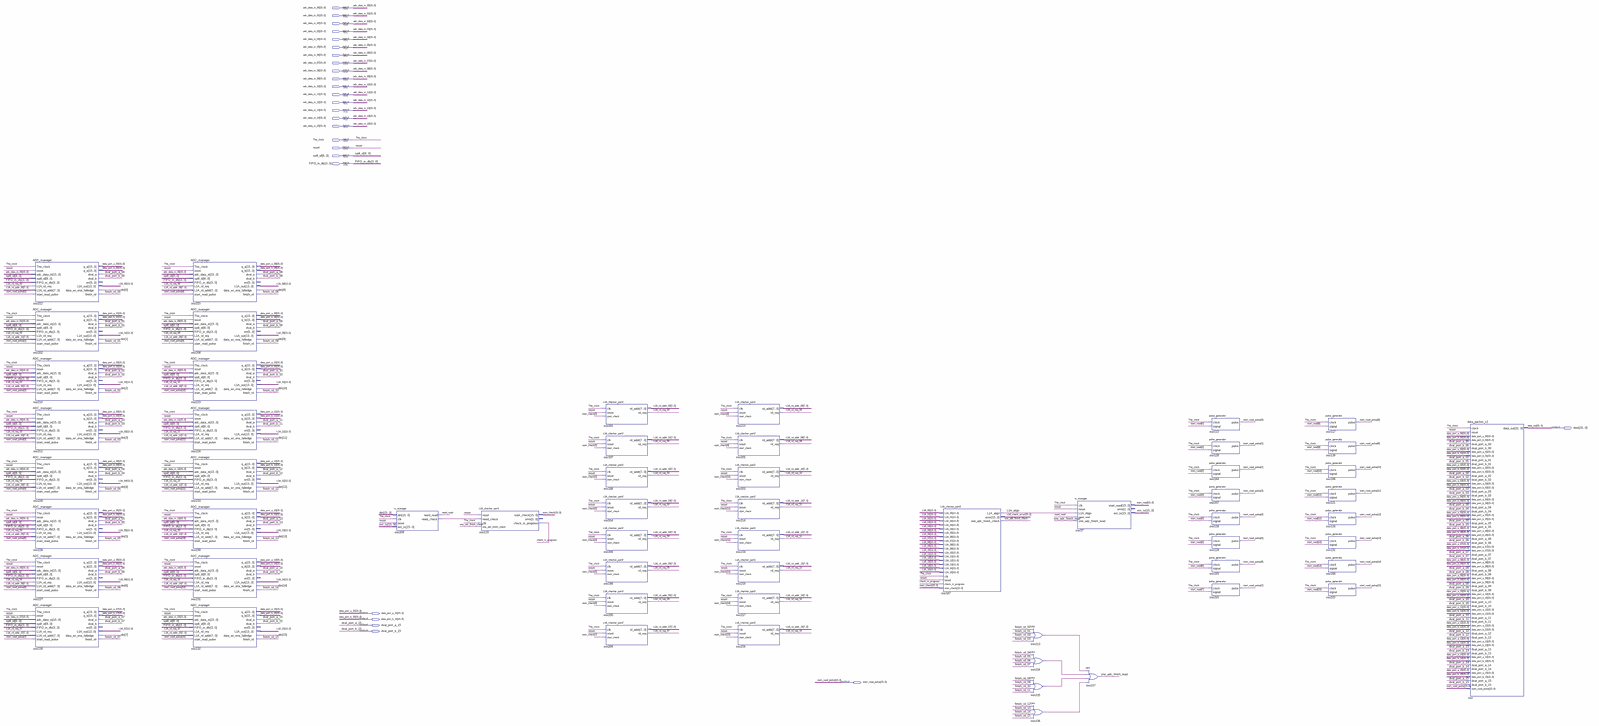
[diagram p0: schematic sheet, whole]
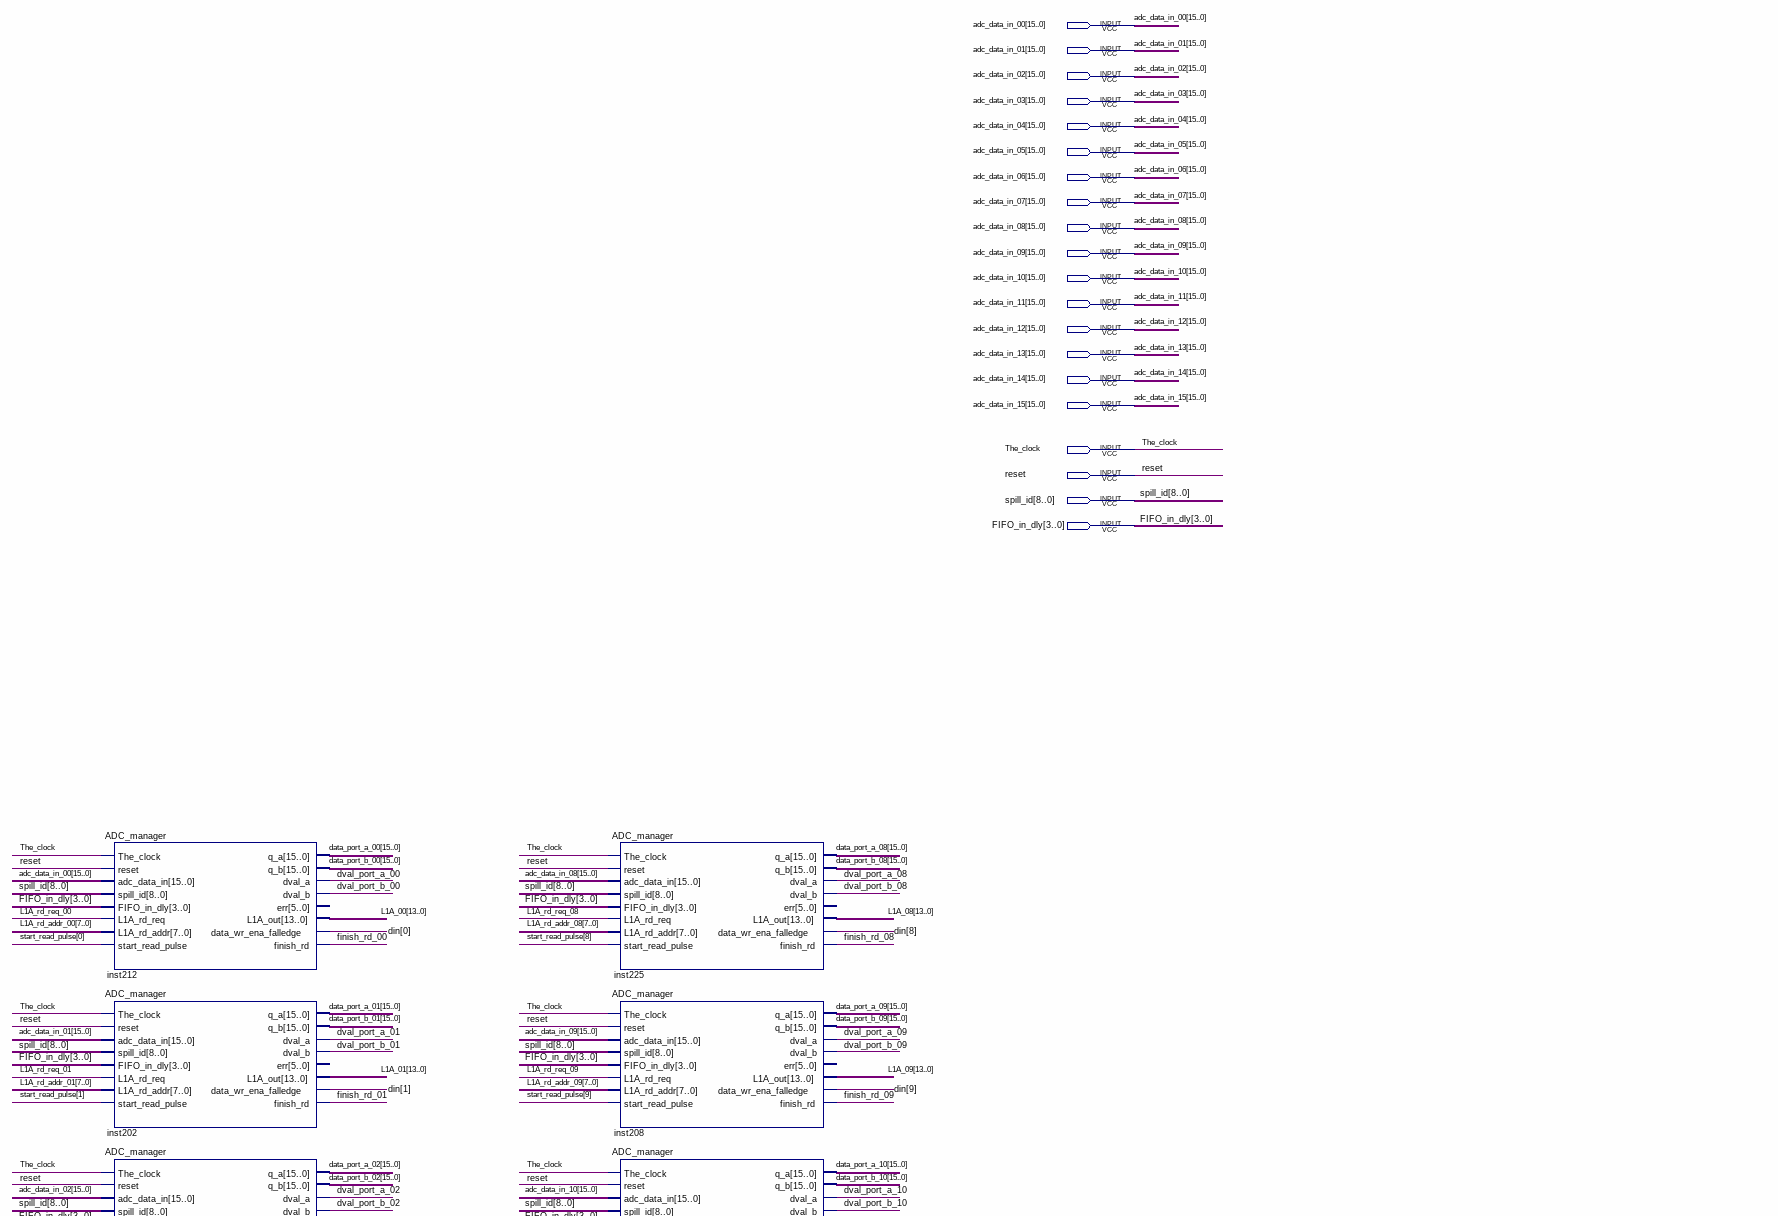
[diagram p1: schematic sheet, upper left part]
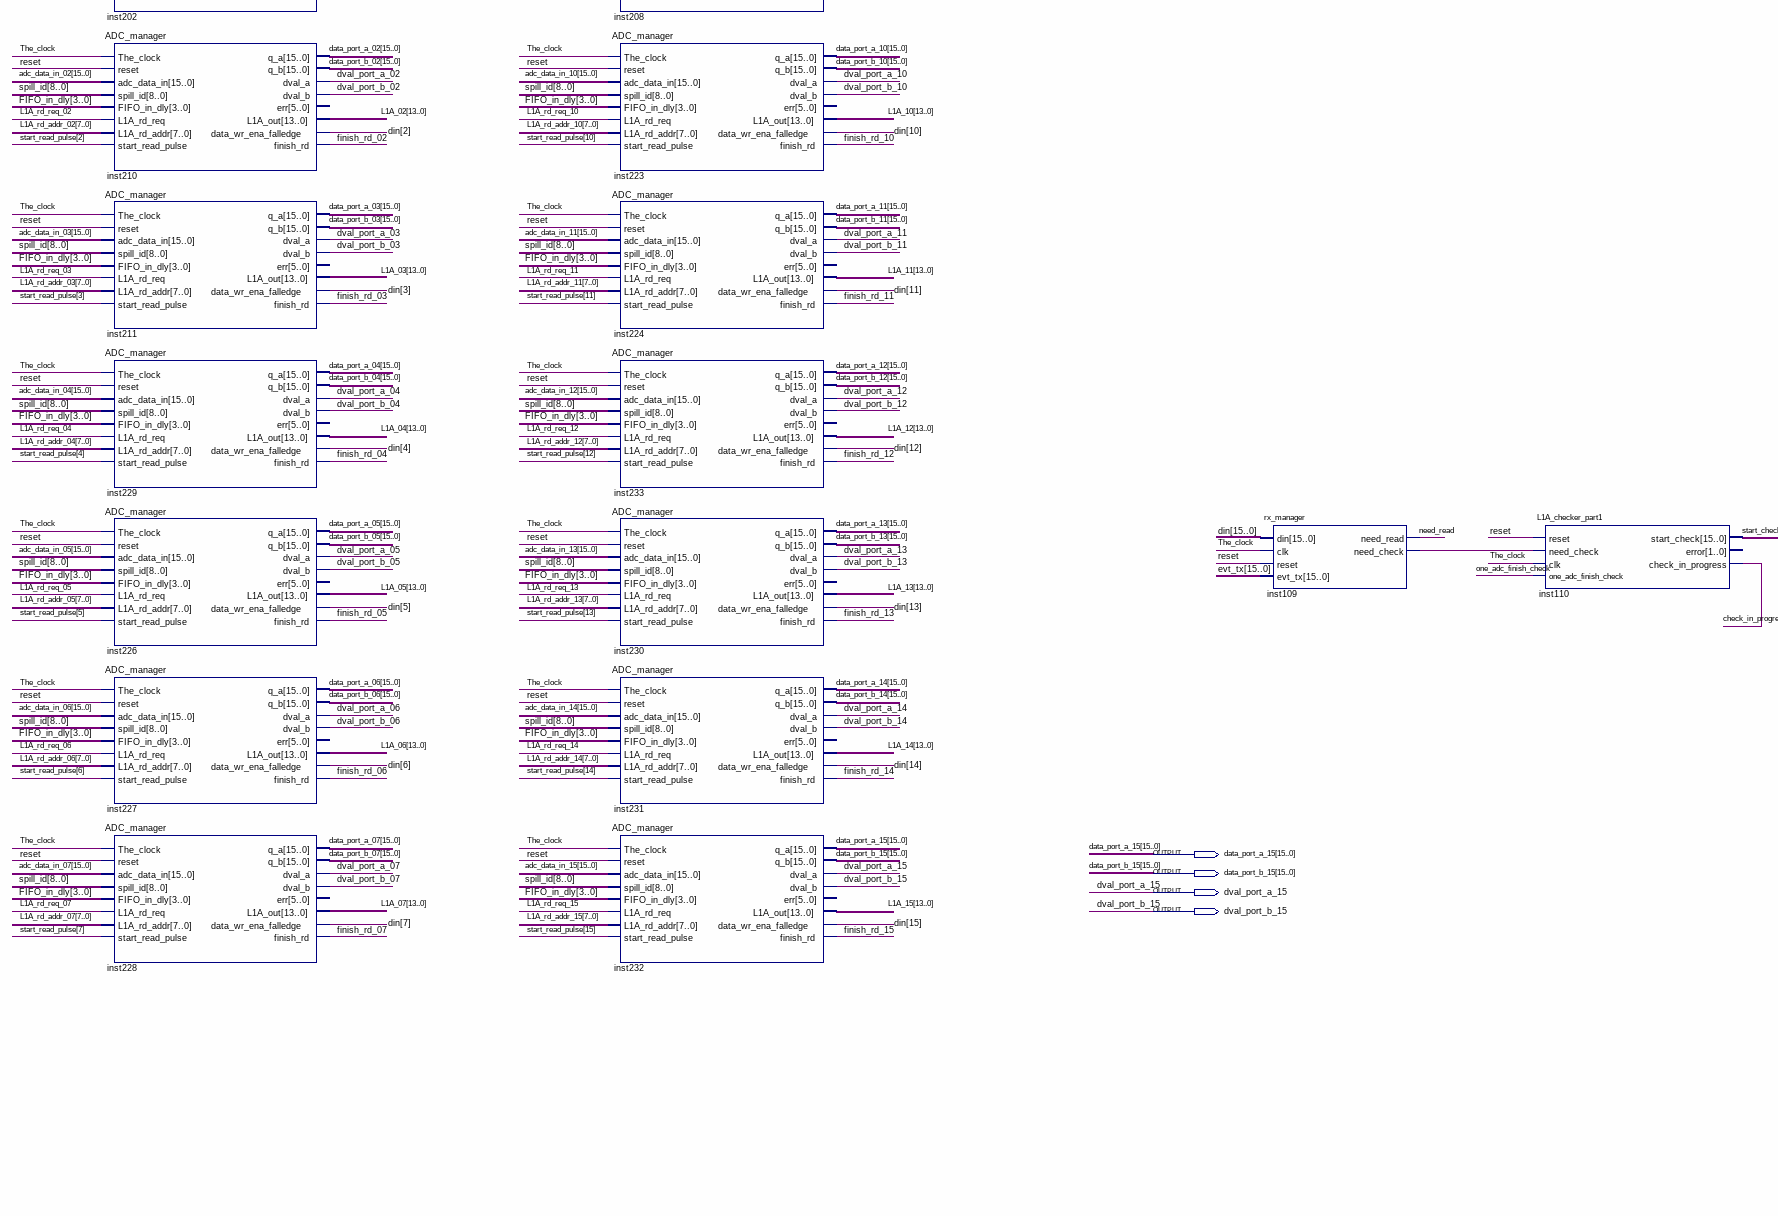
[diagram p2: schematic sheet, lower left part]
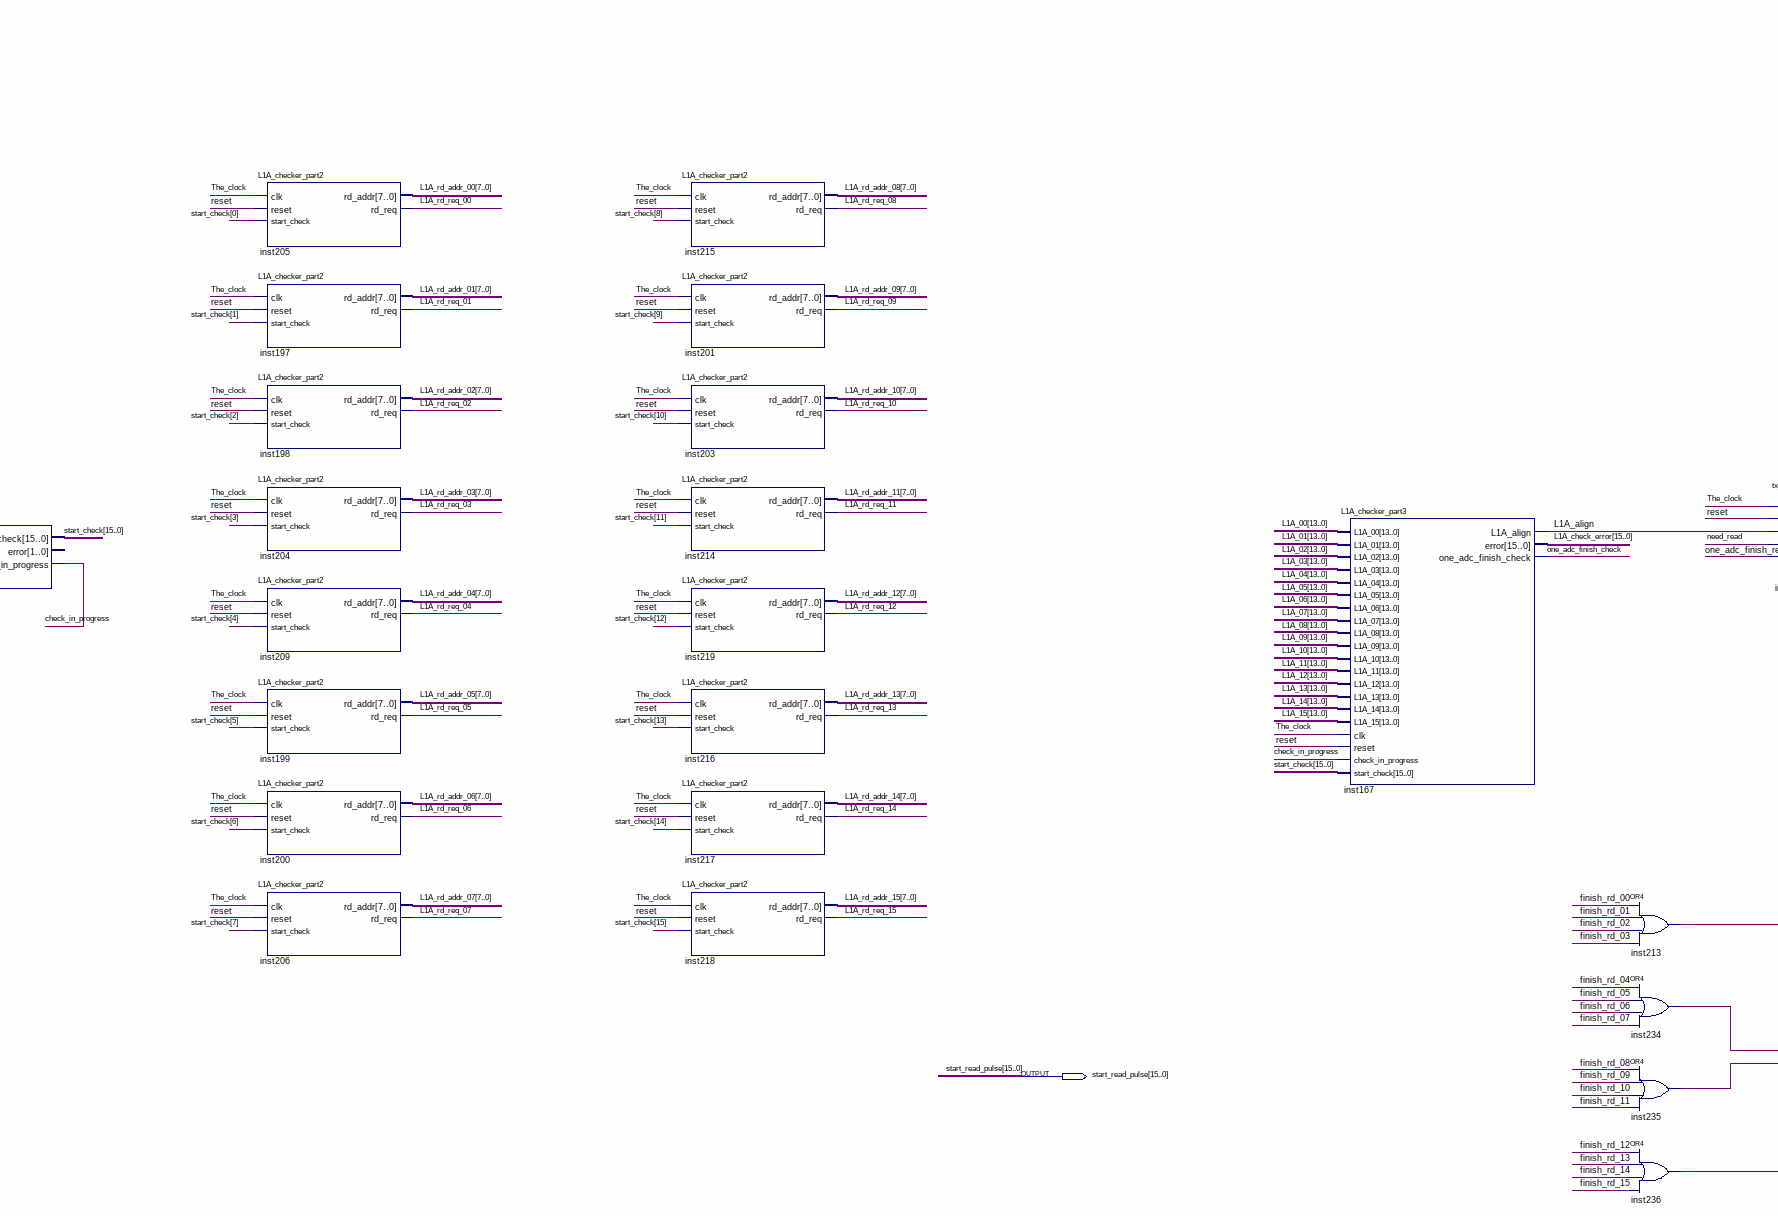
[diagram p3: schematic sheet, lower centre part]
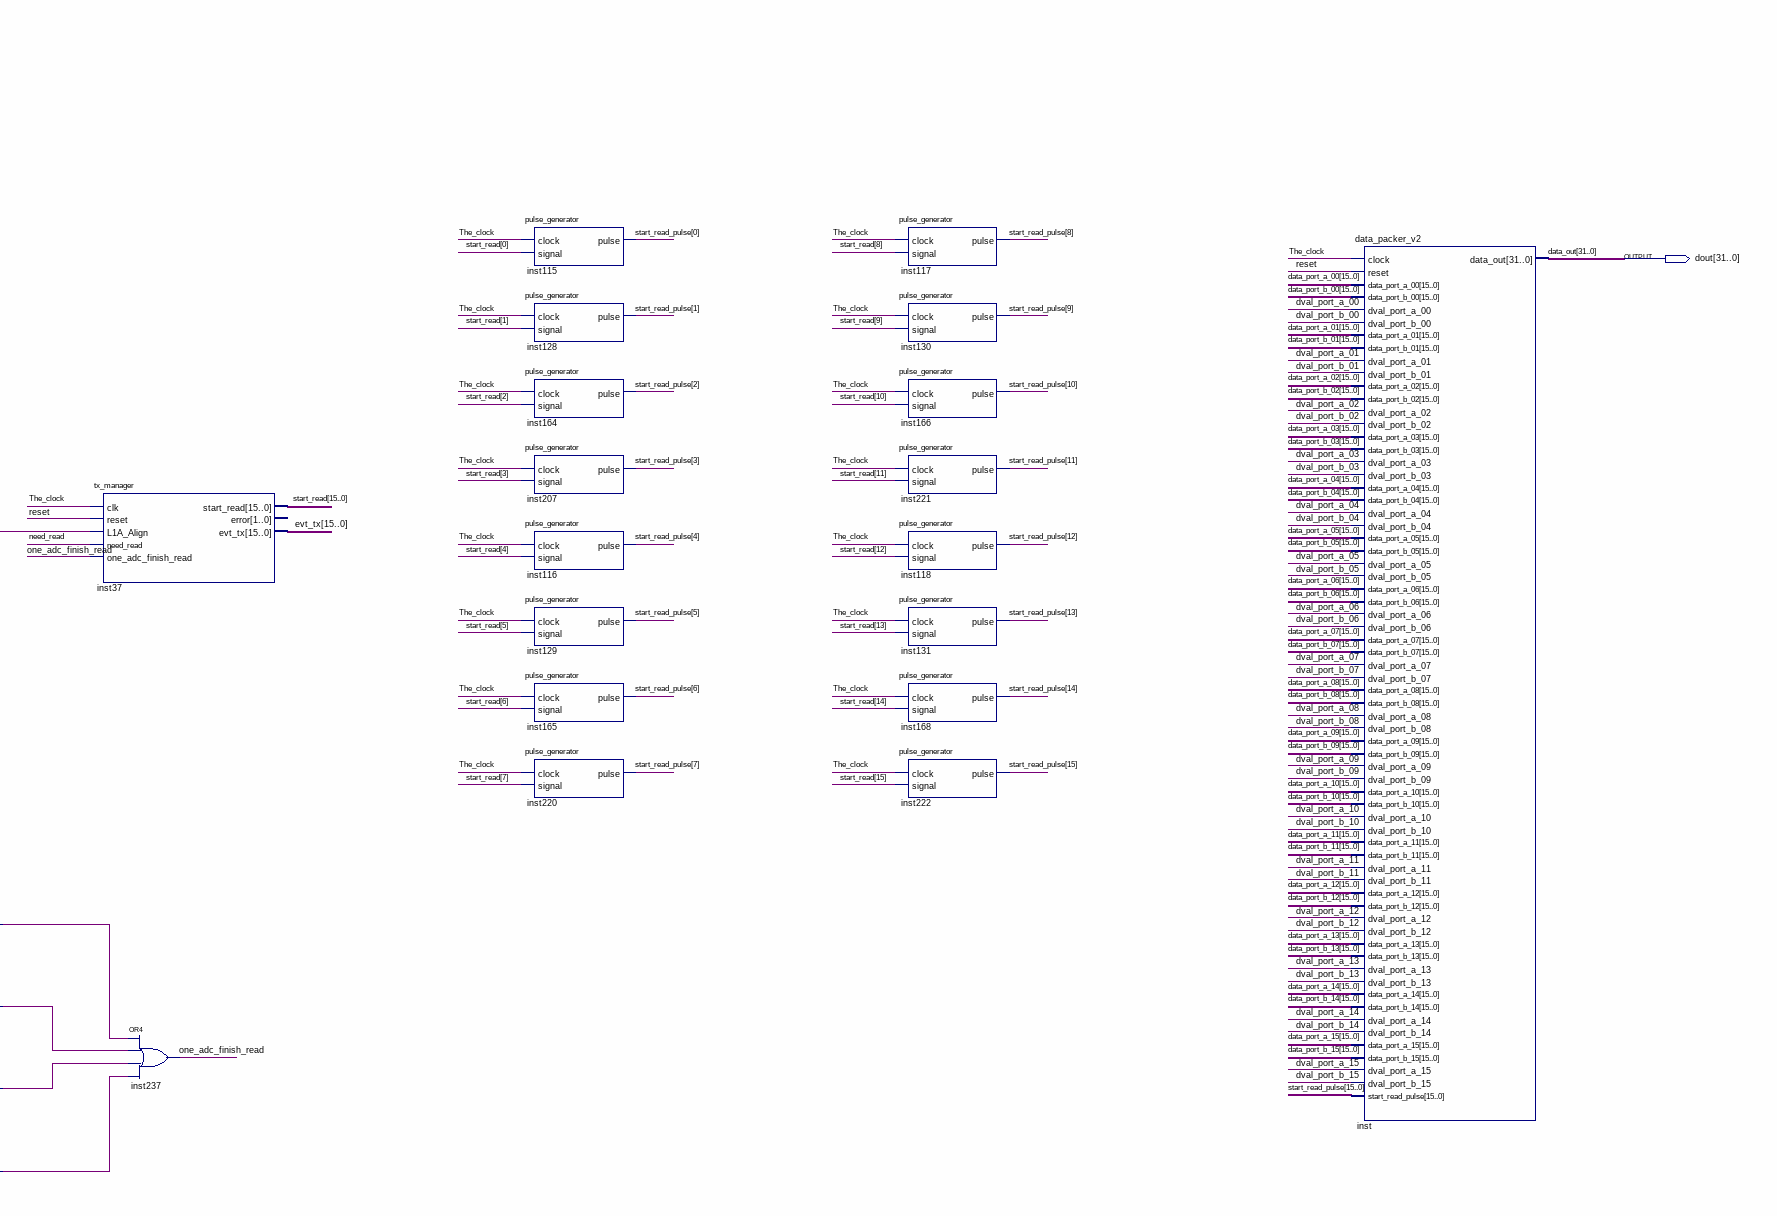
[diagram p4: schematic sheet, lower right part]
// Quartus schematic sim.bdf as structural Verilog: 58 symbols, 26 pins
module sim (
  input  [15:0] adc_data_in_00,
  input  [15:0] adc_data_in_01,
  input  [15:0] adc_data_in_02,
  input  [15:0] adc_data_in_03,
  input  [15:0] adc_data_in_04,
  input  [15:0] adc_data_in_05,
  input  [15:0] adc_data_in_06,
  input  [15:0] adc_data_in_07,
  input  [15:0] adc_data_in_08,
  input  [15:0] adc_data_in_09,
  input  [15:0] adc_data_in_10,
  input  [15:0] adc_data_in_11,
  input  [15:0] adc_data_in_12,
  input  [15:0] adc_data_in_13,
  input  [15:0] adc_data_in_14,
  input  [15:0] adc_data_in_15,
  input  The_clock,
  input  reset,
  input  [8:0] spill_id,
  input  [3:0] FIFO_in_dly,
  output [31:0] dout,
  output [15:0] data_port_a_15,
  output [15:0] data_port_b_15,
  output dval_port_a_15,
  output dval_port_b_15,
  output [15:0] start_read_pulse
);

  wire check_in_progress, dval_port_a_00, dval_port_a_01, dval_port_a_02, dval_port_a_03, dval_port_a_04,
       dval_port_a_05, dval_port_a_06, dval_port_a_07, dval_port_a_08, dval_port_a_09, dval_port_a_10,
       dval_port_a_11, dval_port_a_12, dval_port_a_13, dval_port_a_14, dval_port_b_00, dval_port_b_01,
       dval_port_b_02, dval_port_b_03, dval_port_b_04, dval_port_b_05, dval_port_b_06, dval_port_b_07,
       dval_port_b_08, dval_port_b_09, dval_port_b_10, dval_port_b_11, dval_port_b_12, dval_port_b_13,
       dval_port_b_14, finish_rd_00, finish_rd_01, finish_rd_02, finish_rd_03, finish_rd_04, finish_rd_05,
       finish_rd_06, finish_rd_07, finish_rd_08, finish_rd_09, finish_rd_10, finish_rd_11, finish_rd_12,
       finish_rd_13, finish_rd_14, finish_rd_15, inst109_need_check, inst213_out, inst234_out, inst235_out,
       inst236_out, L1A_align, L1A_rd_req_00, L1A_rd_req_01, L1A_rd_req_02, L1A_rd_req_03, L1A_rd_req_04,
       L1A_rd_req_05, L1A_rd_req_06, L1A_rd_req_07, L1A_rd_req_08, L1A_rd_req_09, L1A_rd_req_10,
       L1A_rd_req_11, L1A_rd_req_12, L1A_rd_req_13, L1A_rd_req_14, L1A_rd_req_15, need_read,
       one_adc_finish_check, one_adc_finish_read;
  wire [7:0] L1A_rd_addr_00, L1A_rd_addr_01, L1A_rd_addr_02, L1A_rd_addr_03, L1A_rd_addr_04, L1A_rd_addr_05,
       L1A_rd_addr_06, L1A_rd_addr_07, L1A_rd_addr_08, L1A_rd_addr_09, L1A_rd_addr_10, L1A_rd_addr_11,
       L1A_rd_addr_12, L1A_rd_addr_13, L1A_rd_addr_14, L1A_rd_addr_15;
  wire [13:0] L1A_00, L1A_01, L1A_02, L1A_03, L1A_04, L1A_05, L1A_06, L1A_07, L1A_08, L1A_09, L1A_10, L1A_11,
       L1A_12, L1A_13, L1A_14, L1A_15;
  wire [15:0] data_port_a_00, data_port_a_01, data_port_a_02, data_port_a_03, data_port_a_04, data_port_a_05,
       data_port_a_06, data_port_a_07, data_port_a_08, data_port_a_09, data_port_a_10, data_port_a_11,
       data_port_a_12, data_port_a_13, data_port_a_14, data_port_b_00, data_port_b_01, data_port_b_02,
       data_port_b_03, data_port_b_04, data_port_b_05, data_port_b_06, data_port_b_07, data_port_b_08,
       data_port_b_09, data_port_b_10, data_port_b_11, data_port_b_12, data_port_b_13, data_port_b_14, din,
       evt_tx, L1A_check_error, start_check, start_read;

  ADC_manager inst212 (
    .The_clock(The_clock), .reset(reset), .adc_data_in(adc_data_in_00), .spill_id(spill_id),
    .FIFO_in_dly(FIFO_in_dly), .L1A_rd_req(L1A_rd_req_00), .L1A_rd_addr(L1A_rd_addr_00),
    .start_read_pulse(start_read_pulse[0]), .q_a(data_port_a_00), .dval_a(dval_port_a_00),
    .q_b(data_port_b_00), .dval_b(dval_port_b_00), .L1A_out(L1A_00), .data_wr_ena_falledge(din[0]),
    .finish_rd(finish_rd_00));  // open: err
  ADC_manager inst202 (
    .The_clock(The_clock), .reset(reset), .adc_data_in(adc_data_in_01), .spill_id(spill_id),
    .FIFO_in_dly(FIFO_in_dly), .L1A_rd_req(L1A_rd_req_01), .L1A_rd_addr(L1A_rd_addr_01),
    .start_read_pulse(start_read_pulse[1]), .q_a(data_port_a_01), .dval_a(dval_port_a_01),
    .q_b(data_port_b_01), .dval_b(dval_port_b_01), .L1A_out(L1A_01), .data_wr_ena_falledge(din[1]),
    .finish_rd(finish_rd_01));  // open: err
  ADC_manager inst210 (
    .The_clock(The_clock), .reset(reset), .adc_data_in(adc_data_in_02), .spill_id(spill_id),
    .FIFO_in_dly(FIFO_in_dly), .L1A_rd_req(L1A_rd_req_02), .L1A_rd_addr(L1A_rd_addr_02),
    .start_read_pulse(start_read_pulse[2]), .q_a(data_port_a_02), .dval_a(dval_port_a_02),
    .q_b(data_port_b_02), .dval_b(dval_port_b_02), .L1A_out(L1A_02), .data_wr_ena_falledge(din[2]),
    .finish_rd(finish_rd_02));  // open: err
  ADC_manager inst211 (
    .The_clock(The_clock), .reset(reset), .adc_data_in(adc_data_in_03), .spill_id(spill_id),
    .FIFO_in_dly(FIFO_in_dly), .L1A_rd_req(L1A_rd_req_03), .L1A_rd_addr(L1A_rd_addr_03),
    .start_read_pulse(start_read_pulse[3]), .q_a(data_port_a_03), .dval_a(dval_port_a_03),
    .q_b(data_port_b_03), .dval_b(dval_port_b_03), .L1A_out(L1A_03), .data_wr_ena_falledge(din[3]),
    .finish_rd(finish_rd_03));  // open: err
  ADC_manager inst229 (
    .The_clock(The_clock), .reset(reset), .adc_data_in(adc_data_in_04), .spill_id(spill_id),
    .FIFO_in_dly(FIFO_in_dly), .L1A_rd_req(L1A_rd_req_04), .L1A_rd_addr(L1A_rd_addr_04),
    .start_read_pulse(start_read_pulse[4]), .q_a(data_port_a_04), .dval_a(dval_port_a_04),
    .q_b(data_port_b_04), .dval_b(dval_port_b_04), .L1A_out(L1A_04), .data_wr_ena_falledge(din[4]),
    .finish_rd(finish_rd_04));  // open: err
  ADC_manager inst226 (
    .The_clock(The_clock), .reset(reset), .adc_data_in(adc_data_in_05), .spill_id(spill_id),
    .FIFO_in_dly(FIFO_in_dly), .L1A_rd_req(L1A_rd_req_05), .L1A_rd_addr(L1A_rd_addr_05),
    .start_read_pulse(start_read_pulse[5]), .q_a(data_port_a_05), .dval_a(dval_port_a_05),
    .q_b(data_port_b_05), .dval_b(dval_port_b_05), .L1A_out(L1A_05), .data_wr_ena_falledge(din[5]),
    .finish_rd(finish_rd_05));  // open: err
  ADC_manager inst227 (
    .The_clock(The_clock), .reset(reset), .adc_data_in(adc_data_in_06), .spill_id(spill_id),
    .FIFO_in_dly(FIFO_in_dly), .L1A_rd_req(L1A_rd_req_06), .L1A_rd_addr(L1A_rd_addr_06),
    .start_read_pulse(start_read_pulse[6]), .q_a(data_port_a_06), .dval_a(dval_port_a_06),
    .q_b(data_port_b_06), .dval_b(dval_port_b_06), .L1A_out(L1A_06), .data_wr_ena_falledge(din[6]),
    .finish_rd(finish_rd_06));  // open: err
  ADC_manager inst228 (
    .The_clock(The_clock), .reset(reset), .adc_data_in(adc_data_in_07), .spill_id(spill_id),
    .FIFO_in_dly(FIFO_in_dly), .L1A_rd_req(L1A_rd_req_07), .L1A_rd_addr(L1A_rd_addr_07),
    .start_read_pulse(start_read_pulse[7]), .q_a(data_port_a_07), .dval_a(dval_port_a_07),
    .q_b(data_port_b_07), .dval_b(dval_port_b_07), .L1A_out(L1A_07), .data_wr_ena_falledge(din[7]),
    .finish_rd(finish_rd_07));  // open: err
  ADC_manager inst225 (
    .The_clock(The_clock), .reset(reset), .adc_data_in(adc_data_in_08), .spill_id(spill_id),
    .FIFO_in_dly(FIFO_in_dly), .L1A_rd_req(L1A_rd_req_08), .L1A_rd_addr(L1A_rd_addr_08),
    .start_read_pulse(start_read_pulse[8]), .q_a(data_port_a_08), .dval_a(dval_port_a_08),
    .q_b(data_port_b_08), .dval_b(dval_port_b_08), .L1A_out(L1A_08), .data_wr_ena_falledge(din[8]),
    .finish_rd(finish_rd_08));  // open: err
  ADC_manager inst208 (
    .The_clock(The_clock), .reset(reset), .adc_data_in(adc_data_in_09), .spill_id(spill_id),
    .FIFO_in_dly(FIFO_in_dly), .L1A_rd_req(L1A_rd_req_09), .L1A_rd_addr(L1A_rd_addr_09),
    .start_read_pulse(start_read_pulse[9]), .q_a(data_port_a_09), .dval_a(dval_port_a_09),
    .q_b(data_port_b_09), .dval_b(dval_port_b_09), .L1A_out(L1A_09), .data_wr_ena_falledge(din[9]),
    .finish_rd(finish_rd_09));  // open: err
  ADC_manager inst223 (
    .The_clock(The_clock), .reset(reset), .adc_data_in(adc_data_in_10), .spill_id(spill_id),
    .FIFO_in_dly(FIFO_in_dly), .L1A_rd_req(L1A_rd_req_10), .L1A_rd_addr(L1A_rd_addr_10),
    .start_read_pulse(start_read_pulse[10]), .q_a(data_port_a_10), .dval_a(dval_port_a_10),
    .q_b(data_port_b_10), .dval_b(dval_port_b_10), .L1A_out(L1A_10), .data_wr_ena_falledge(din[10]),
    .finish_rd(finish_rd_10));  // open: err
  ADC_manager inst224 (
    .The_clock(The_clock), .reset(reset), .adc_data_in(adc_data_in_11), .spill_id(spill_id),
    .FIFO_in_dly(FIFO_in_dly), .L1A_rd_req(L1A_rd_req_11), .L1A_rd_addr(L1A_rd_addr_11),
    .start_read_pulse(start_read_pulse[11]), .q_a(data_port_a_11), .dval_a(dval_port_a_11),
    .q_b(data_port_b_11), .dval_b(dval_port_b_11), .L1A_out(L1A_11), .data_wr_ena_falledge(din[11]),
    .finish_rd(finish_rd_11));  // open: err
  ADC_manager inst233 (
    .The_clock(The_clock), .reset(reset), .adc_data_in(adc_data_in_12), .spill_id(spill_id),
    .FIFO_in_dly(FIFO_in_dly), .L1A_rd_req(L1A_rd_req_12), .L1A_rd_addr(L1A_rd_addr_12),
    .start_read_pulse(start_read_pulse[12]), .q_a(data_port_a_12), .dval_a(dval_port_a_12),
    .q_b(data_port_b_12), .dval_b(dval_port_b_12), .L1A_out(L1A_12), .data_wr_ena_falledge(din[12]),
    .finish_rd(finish_rd_12));  // open: err
  ADC_manager inst230 (
    .The_clock(The_clock), .reset(reset), .adc_data_in(adc_data_in_13), .spill_id(spill_id),
    .FIFO_in_dly(FIFO_in_dly), .L1A_rd_req(L1A_rd_req_13), .L1A_rd_addr(L1A_rd_addr_13),
    .start_read_pulse(start_read_pulse[13]), .q_a(data_port_a_13), .dval_a(dval_port_a_13),
    .q_b(data_port_b_13), .dval_b(dval_port_b_13), .L1A_out(L1A_13), .data_wr_ena_falledge(din[13]),
    .finish_rd(finish_rd_13));  // open: err
  ADC_manager inst231 (
    .The_clock(The_clock), .reset(reset), .adc_data_in(adc_data_in_14), .spill_id(spill_id),
    .FIFO_in_dly(FIFO_in_dly), .L1A_rd_req(L1A_rd_req_14), .L1A_rd_addr(L1A_rd_addr_14),
    .start_read_pulse(start_read_pulse[14]), .q_a(data_port_a_14), .dval_a(dval_port_a_14),
    .q_b(data_port_b_14), .dval_b(dval_port_b_14), .L1A_out(L1A_14), .data_wr_ena_falledge(din[14]),
    .finish_rd(finish_rd_14));  // open: err
  ADC_manager inst232 (
    .The_clock(The_clock), .reset(reset), .adc_data_in(adc_data_in_15), .spill_id(spill_id),
    .FIFO_in_dly(FIFO_in_dly), .L1A_rd_req(L1A_rd_req_15), .L1A_rd_addr(L1A_rd_addr_15),
    .start_read_pulse(start_read_pulse[15]), .q_a(data_port_a_15), .dval_a(dval_port_a_15),
    .q_b(data_port_b_15), .dval_b(dval_port_b_15), .L1A_out(L1A_15), .data_wr_ena_falledge(din[15]),
    .finish_rd(finish_rd_15));  // open: err
  rx_manager inst109 (
    .din(din), .clk(The_clock), .reset(reset), .evt_tx(evt_tx), .need_read(need_read),
    .need_check(inst109_need_check));
  L1A_checker_part1 inst110 (
    .reset(reset), .need_check(inst109_need_check), .clk(The_clock),
    .one_adc_finish_check(one_adc_finish_check), .start_check(start_check),
    .check_in_progress(check_in_progress));  // open: error
  L1A_checker_part2 inst205 (
    .clk(The_clock), .reset(reset), .start_check(start_check[0]), .rd_addr(L1A_rd_addr_00),
    .rd_req(L1A_rd_req_00));
  L1A_checker_part2 inst197 (
    .clk(The_clock), .reset(reset), .start_check(start_check[1]), .rd_addr(L1A_rd_addr_01),
    .rd_req(L1A_rd_req_01));
  L1A_checker_part2 inst198 (
    .clk(The_clock), .reset(reset), .start_check(start_check[2]), .rd_addr(L1A_rd_addr_02),
    .rd_req(L1A_rd_req_02));
  L1A_checker_part2 inst204 (
    .clk(The_clock), .reset(reset), .start_check(start_check[3]), .rd_addr(L1A_rd_addr_03),
    .rd_req(L1A_rd_req_03));
  L1A_checker_part2 inst209 (
    .clk(The_clock), .reset(reset), .start_check(start_check[4]), .rd_addr(L1A_rd_addr_04),
    .rd_req(L1A_rd_req_04));
  L1A_checker_part2 inst199 (
    .clk(The_clock), .reset(reset), .start_check(start_check[5]), .rd_addr(L1A_rd_addr_05),
    .rd_req(L1A_rd_req_05));
  L1A_checker_part2 inst200 (
    .clk(The_clock), .reset(reset), .start_check(start_check[6]), .rd_addr(L1A_rd_addr_06),
    .rd_req(L1A_rd_req_06));
  L1A_checker_part2 inst206 (
    .clk(The_clock), .reset(reset), .start_check(start_check[7]), .rd_addr(L1A_rd_addr_07),
    .rd_req(L1A_rd_req_07));
  L1A_checker_part2 inst215 (
    .clk(The_clock), .reset(reset), .start_check(start_check[8]), .rd_addr(L1A_rd_addr_08),
    .rd_req(L1A_rd_req_08));
  L1A_checker_part2 inst201 (
    .clk(The_clock), .reset(reset), .start_check(start_check[9]), .rd_addr(L1A_rd_addr_09),
    .rd_req(L1A_rd_req_09));
  L1A_checker_part2 inst203 (
    .clk(The_clock), .reset(reset), .start_check(start_check[10]), .rd_addr(L1A_rd_addr_10),
    .rd_req(L1A_rd_req_10));
  L1A_checker_part2 inst214 (
    .clk(The_clock), .reset(reset), .start_check(start_check[11]), .rd_addr(L1A_rd_addr_11),
    .rd_req(L1A_rd_req_11));
  L1A_checker_part2 inst219 (
    .clk(The_clock), .reset(reset), .start_check(start_check[12]), .rd_addr(L1A_rd_addr_12),
    .rd_req(L1A_rd_req_12));
  L1A_checker_part2 inst216 (
    .clk(The_clock), .reset(reset), .start_check(start_check[13]), .rd_addr(L1A_rd_addr_13),
    .rd_req(L1A_rd_req_13));
  L1A_checker_part2 inst217 (
    .clk(The_clock), .reset(reset), .start_check(start_check[14]), .rd_addr(L1A_rd_addr_14),
    .rd_req(L1A_rd_req_14));
  L1A_checker_part2 inst218 (
    .clk(The_clock), .reset(reset), .start_check(start_check[15]), .rd_addr(L1A_rd_addr_15),
    .rd_req(L1A_rd_req_15));
  L1A_checker_part3 inst167 (
    .L1A_00(L1A_00), .L1A_01(L1A_01), .L1A_02(L1A_02), .L1A_03(L1A_03), .L1A_04(L1A_04), .L1A_05(L1A_05),
    .L1A_06(L1A_06), .L1A_07(L1A_07), .L1A_08(L1A_08), .L1A_09(L1A_09), .L1A_10(L1A_10), .L1A_11(L1A_11),
    .L1A_12(L1A_12), .L1A_13(L1A_13), .L1A_14(L1A_14), .L1A_15(L1A_15), .clk(The_clock), .reset(reset),
    .check_in_progress(check_in_progress), .start_check(start_check), .L1A_align(L1A_align),
    .error(L1A_check_error), .one_adc_finish_check(one_adc_finish_check));
  or inst213 (inst213_out, finish_rd_00, finish_rd_01, finish_rd_02, finish_rd_03);
  or inst234 (inst234_out, finish_rd_04, finish_rd_05, finish_rd_06, finish_rd_07);
  or inst235 (inst235_out, finish_rd_08, finish_rd_09, finish_rd_10, finish_rd_11);
  or inst236 (inst236_out, finish_rd_12, finish_rd_13, finish_rd_14, finish_rd_15);
  tx_manager inst37 (
    .clk(The_clock), .reset(reset), .L1A_Align(L1A_align), .need_read(need_read),
    .one_adc_finish_read(one_adc_finish_read), .start_read(start_read), .evt_tx(evt_tx));  // open: error
  or inst237 (one_adc_finish_read, inst213_out, inst234_out, inst235_out, inst236_out);
  pulse_generator inst115 (.clock(The_clock), .signal(start_read[0]), .pulse(start_read_pulse[0]));
  pulse_generator inst128 (.clock(The_clock), .signal(start_read[1]), .pulse(start_read_pulse[1]));
  pulse_generator inst164 (.clock(The_clock), .signal(start_read[2]), .pulse(start_read_pulse[2]));
  pulse_generator inst207 (.clock(The_clock), .signal(start_read[3]), .pulse(start_read_pulse[3]));
  pulse_generator inst116 (.clock(The_clock), .signal(start_read[4]), .pulse(start_read_pulse[4]));
  pulse_generator inst129 (.clock(The_clock), .signal(start_read[5]), .pulse(start_read_pulse[5]));
  pulse_generator inst165 (.clock(The_clock), .signal(start_read[6]), .pulse(start_read_pulse[6]));
  pulse_generator inst220 (.clock(The_clock), .signal(start_read[7]), .pulse(start_read_pulse[7]));
  pulse_generator inst117 (.clock(The_clock), .signal(start_read[8]), .pulse(start_read_pulse[8]));
  pulse_generator inst130 (.clock(The_clock), .signal(start_read[9]), .pulse(start_read_pulse[9]));
  pulse_generator inst166 (.clock(The_clock), .signal(start_read[10]), .pulse(start_read_pulse[10]));
  pulse_generator inst221 (.clock(The_clock), .signal(start_read[11]), .pulse(start_read_pulse[11]));
  pulse_generator inst118 (.clock(The_clock), .signal(start_read[12]), .pulse(start_read_pulse[12]));
  pulse_generator inst131 (.clock(The_clock), .signal(start_read[13]), .pulse(start_read_pulse[13]));
  pulse_generator inst168 (.clock(The_clock), .signal(start_read[14]), .pulse(start_read_pulse[14]));
  pulse_generator inst222 (.clock(The_clock), .signal(start_read[15]), .pulse(start_read_pulse[15]));
  data_packer_v2 inst (
    .clock(The_clock), .reset(reset), .data_port_a_00(data_port_a_00), .data_port_b_00(data_port_b_00),
    .dval_port_a_00(dval_port_a_00), .dval_port_b_00(dval_port_b_00), .data_port_a_01(data_port_a_01),
    .data_port_b_01(data_port_b_01), .dval_port_a_01(dval_port_a_01), .dval_port_b_01(dval_port_b_01),
    .data_port_a_02(data_port_a_02), .data_port_b_02(data_port_b_02), .dval_port_a_02(dval_port_a_02),
    .dval_port_b_02(dval_port_b_02), .data_port_a_03(data_port_a_03), .data_port_b_03(data_port_b_03),
    .dval_port_a_03(dval_port_a_03), .dval_port_b_03(dval_port_b_03), .data_port_a_04(data_port_a_04),
    .data_port_b_04(data_port_b_04), .dval_port_a_04(dval_port_a_04), .dval_port_b_04(dval_port_b_04),
    .data_port_a_05(data_port_a_05), .data_port_b_05(data_port_b_05), .dval_port_a_05(dval_port_a_05),
    .dval_port_b_05(dval_port_b_05), .data_port_a_06(data_port_a_06), .data_port_b_06(data_port_b_06),
    .dval_port_a_06(dval_port_a_06), .dval_port_b_06(dval_port_b_06), .data_port_a_07(data_port_a_07),
    .data_port_b_07(data_port_b_07), .dval_port_a_07(dval_port_a_07), .dval_port_b_07(dval_port_b_07),
    .data_port_a_08(data_port_a_08), .data_port_b_08(data_port_b_08), .dval_port_a_08(dval_port_a_08),
    .dval_port_b_08(dval_port_b_08), .data_port_a_09(data_port_a_09), .data_port_b_09(data_port_b_09),
    .dval_port_a_09(dval_port_a_09), .dval_port_b_09(dval_port_b_09), .data_port_a_10(data_port_a_10),
    .data_port_b_10(data_port_b_10), .dval_port_a_10(dval_port_a_10), .dval_port_b_10(dval_port_b_10),
    .data_port_a_11(data_port_a_11), .data_port_b_11(data_port_b_11), .dval_port_a_11(dval_port_a_11),
    .dval_port_b_11(dval_port_b_11), .data_port_a_12(data_port_a_12), .data_port_b_12(data_port_b_12),
    .dval_port_a_12(dval_port_a_12), .dval_port_b_12(dval_port_b_12), .data_port_a_13(data_port_a_13),
    .data_port_b_13(data_port_b_13), .dval_port_a_13(dval_port_a_13), .dval_port_b_13(dval_port_b_13),
    .data_port_a_14(data_port_a_14), .data_port_b_14(data_port_b_14), .dval_port_a_14(dval_port_a_14),
    .dval_port_b_14(dval_port_b_14), .data_port_a_15(data_port_a_15), .data_port_b_15(data_port_b_15),
    .dval_port_a_15(dval_port_a_15), .dval_port_b_15(dval_port_b_15), .start_read_pulse(start_read_pulse),
    .data_out(dout));

  // Other names for the same wires on the sheet: data_out[31:0] = dout
endmodule
